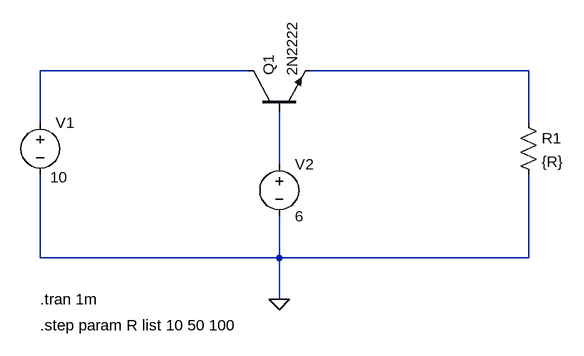
[diagram p0: schematic prof_15_seriese_regurator.asc]
prof_15_seriese_regurator.asc, the LTspice schematic file:
Version 4
SHEET 1 1680 1048
WIRE 1136 640 816 640
WIRE 1568 640 1232 640
WIRE 816 720 816 640
WIRE 1568 720 1568 640
WIRE 1184 784 1184 704
WIRE 816 928 816 800
WIRE 1184 928 1184 864
WIRE 1184 928 816 928
WIRE 1568 928 1568 800
WIRE 1568 928 1184 928
WIRE 1184 992 1184 928
FLAG 1184 992 0
SYMBOL res 1552 704 R0
SYMATTR InstName R1
SYMATTR Value {R}
SYMBOL voltage 816 704 R0
WINDOW 3 15 100 Left 2
SYMATTR Value 10
SYMATTR InstName V1
SYMATTR SpiceLine Rser=0
SYMBOL voltage 1184 768 R0
SYMATTR InstName V2
SYMATTR Value 6
SYMBOL npn 1136 704 R270
SYMATTR InstName Q1
SYMATTR Value 2N2222
TEXT 816 992 Left 2 !.tran 1m
TEXT 816 1032 Left 2 !.step param R list 10 50 100

The netlist it stands for:
* prof_15_seriese_regurator.asc
R1 N002 0 {R}
V1 N001 0 10 Rser=0
V2 N003 0 6
Q1 N001 N003 N002 0 2N2222
.model NPN NPN
.model PNP PNP
.lib standard.bjt
.tran 1m
.step param R list 10 50 100
.backanno
.end